# Altium project MBR.PrjPcb
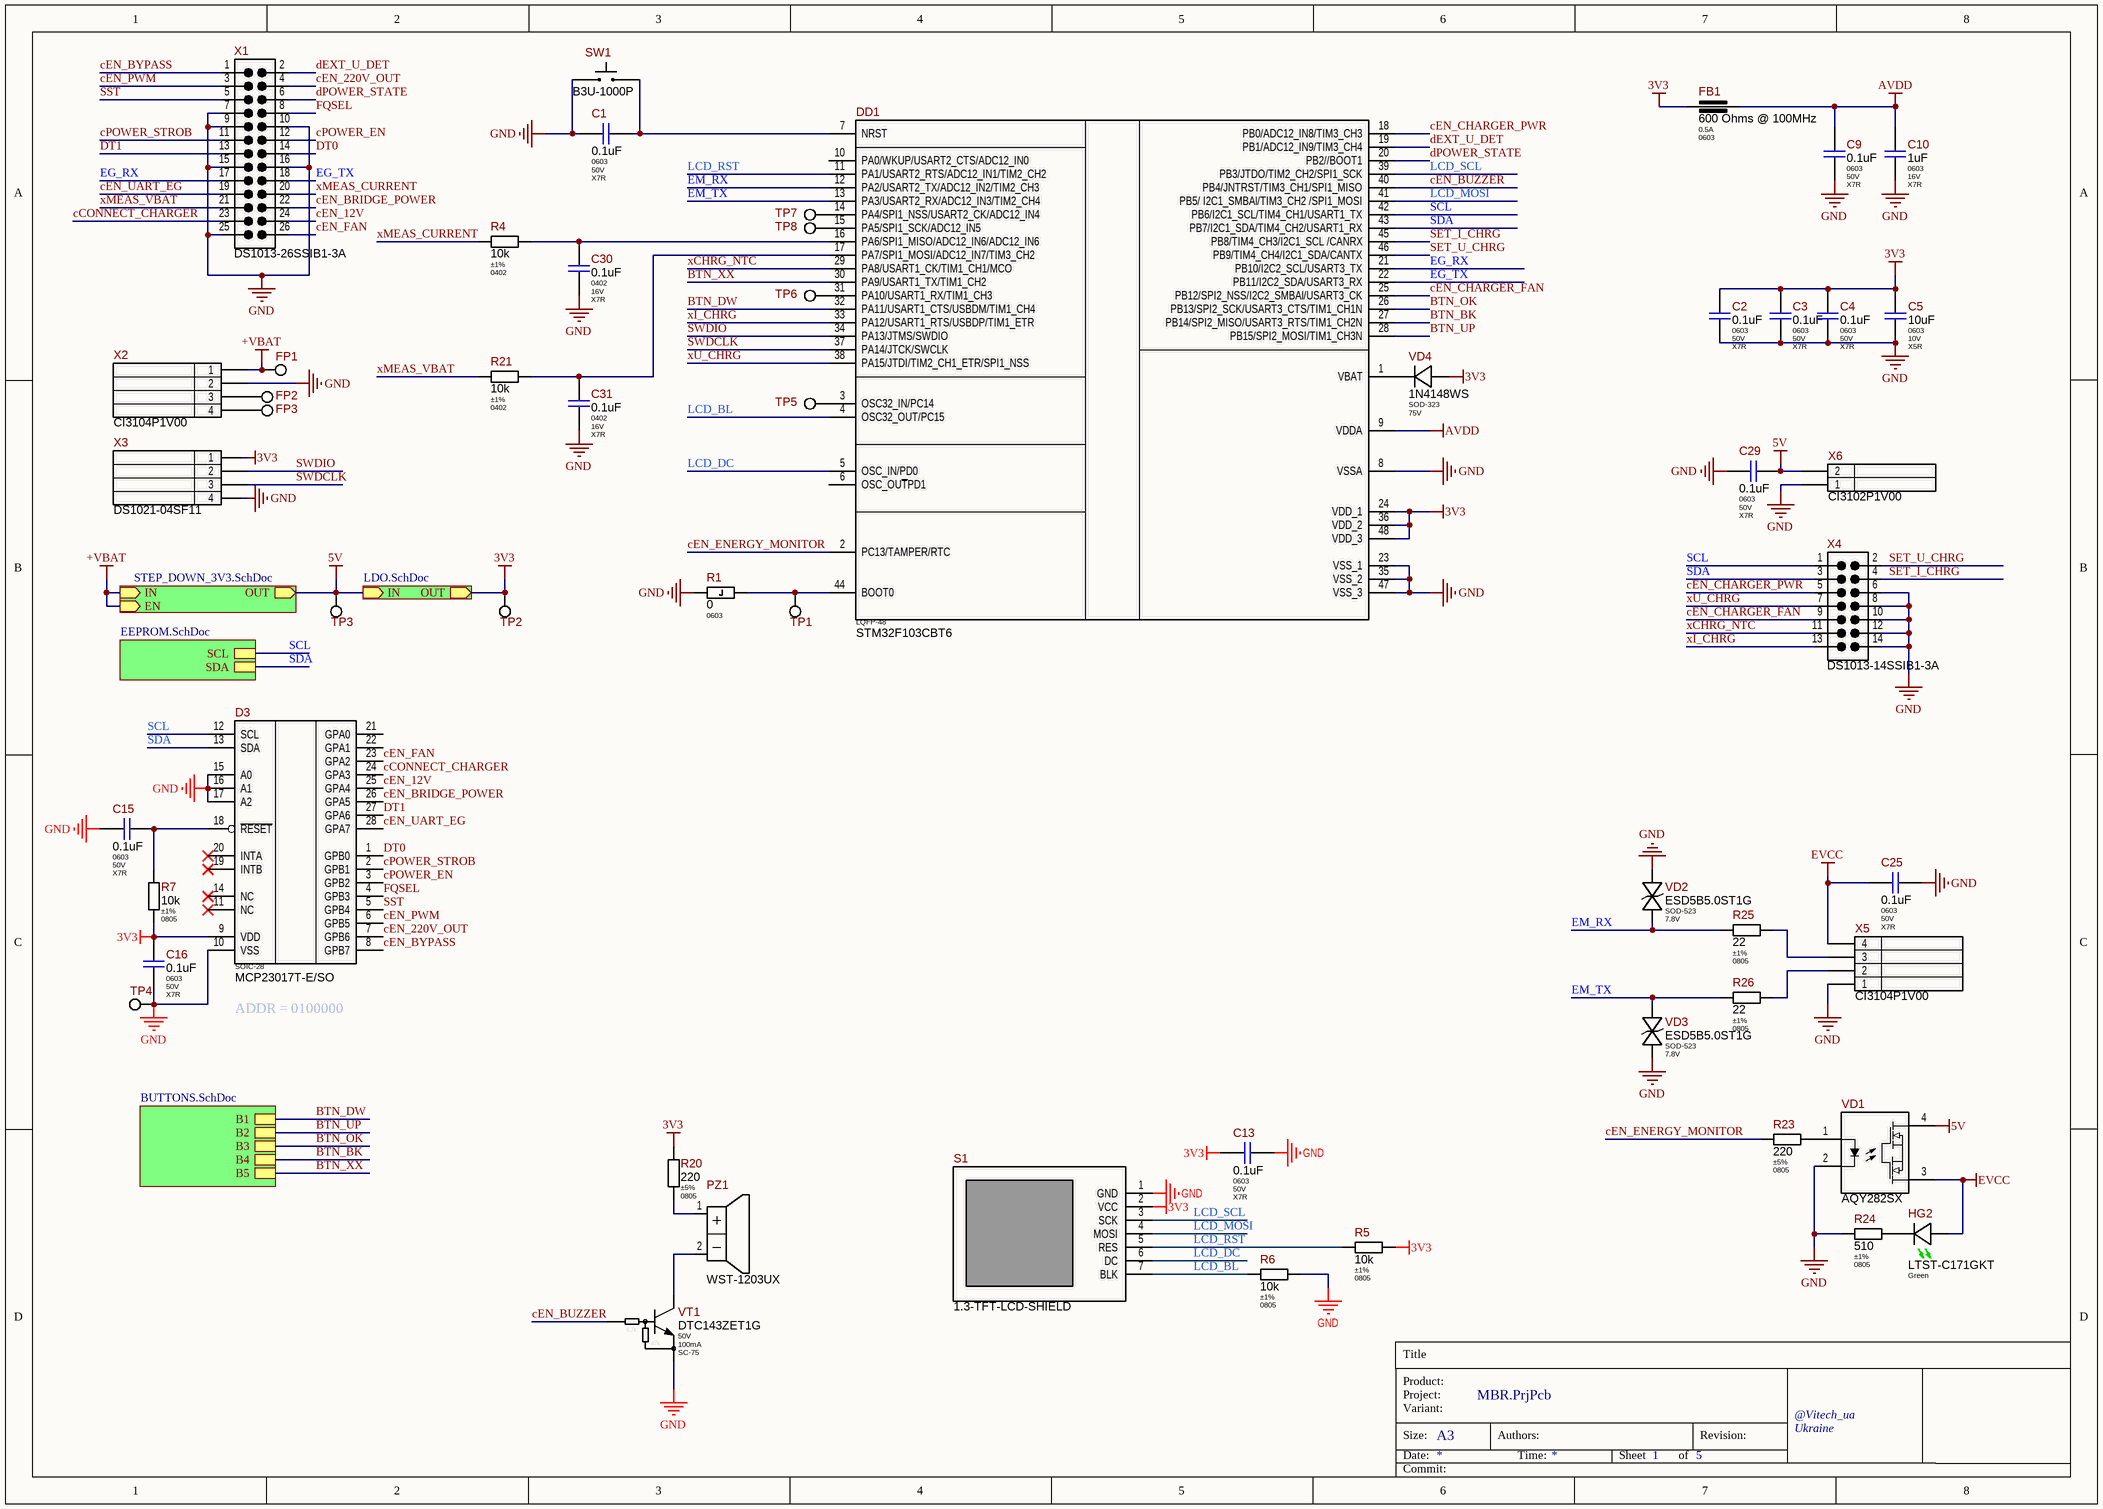
[diagram p0: MBR.SchDoc]
__Project_Template_Version: 1.0.2; _Amount_Boards_Per_Stand: 1; _PCB_Order_Accuracy: 0.2mm / 8mil; _PCB_Order_BoardOutlineLayer: Mechanical1 (GM1); _PCB_Order_Cooper: 1oz / 35um; _PCB_Order_ElectricTest: Necessarily for 100% samples; _PCB_Order_Finish: HASL; _PCB_Order_LayersCnt: 2; _PCB_Order_Mask: on both sides; _PCB_Order_MaskColor: Green / Yellow; _PCB_Order_Material: FR-4; _PCB_Order_MinHole: 0.3 mm; _PCB_Order_ProductionTime: 2 weeks; _PCB_Order_Silk: No; _PCB_Order_SilkColor: No; _PCB_Order_Size: 0 x 0 mm; _PCB_Order_Thickness: 1.6 mm; Authors: Vitech-ua; Product_Name: INVERTOR; Project_ID: 002; Project_Version: 1
5 sheets, 97 parts. Net scope: hierarchical (ports join the sheet entries above them; power ports are global).
Board file: MBR.PcbDoc
Sheets:
  MBR.SchDoc
    STEP_DOWN = STEP_DOWN_3V3.SchDoc
    EEPROM = EEPROM.SchDoc
    Designator = LDO.SchDoc
    Designator = BUTTONS.SchDoc

## Sheet MBR.SchDoc: =DocumentName
size A3; Author: Vitech-ua; CompanyName: "AS Manufacturing" LLC; Organization: "AS Manufacturing" LLC; Address1: 5 Sklyarenka St.; Address2: Kyiv 04073; Address3: Ukraine; Address4: https://ajax.systems/en/; Revision: v1; SheetNumber: 1; SheetTotal: 5; Product name: INVERTOR; Internal reference: 002; Head: INVERTOR.002.v1; PCB_Designator: INVERTOR.002.v1; Template_version: 1.0.1

### Parts
C1  Package: 0603  Voltage: 50V  Dielectric Type: X7R  [C_CERAMIC_0603_MED]  (hidden comment: 0.1uF)
C2  Package: 0603  Voltage: 50V  Dielectric Type: X7R  [C_CERAMIC_0603_MED]  (hidden comment: 0.1uF)
C3  Package: 0603  Voltage: 50V  Dielectric Type: X7R  [C_CERAMIC_0603_MED]  (hidden comment: 0.1uF)
C4  Package: 0603  Voltage: 50V  Dielectric Type: X7R  [C_CERAMIC_0603_MED]  (hidden comment: 0.1uF)
C5  Package: 0603  Voltage: 10V  Dielectric Type: X5R  [C_CERAMIC_0603_MED]  (hidden comment: 10uF)
C9  Package: 0603  Voltage: 50V  Dielectric Type: X7R  [C_CERAMIC_0603_MED]  (hidden comment: 0.1uF)
C10  Package: 0603  Voltage: 16V  Dielectric Type: X7R  [C_CERAMIC_0603_MED]  (hidden comment: 1uF)
C13  Package: 0603  Voltage: 50V  Dielectric Type: X7R  [C_CERAMIC_0603_MED]  (hidden comment: 0.1uF)
C15  Package: 0603  Voltage: 50V  Dielectric Type: X7R  [C_CERAMIC_0603_MED]  (hidden comment: 0.1uF)
C16  Package: 0603  Voltage: 50V  Dielectric Type: X7R  [C_CERAMIC_0603_MED]  (hidden comment: 0.1uF)
C25  Package: 0603  Voltage: 50V  Dielectric Type: X7R  [C_CERAMIC_0603_MED]  (hidden comment: 0.1uF)
C29  Package: 0603  Voltage: 50V  Dielectric Type: X7R  [C_CERAMIC_0603_MED]  (hidden comment: 0.1uF)
C30  Package: 0402  Voltage: 16V  Dielectric Type: X7R  [C_CERAMIC_0402_MED]  (hidden comment: 0.1uF)
C31  Package: 0402  Voltage: 16V  Dielectric Type: X7R  [C_CERAMIC_0402_MED]  (hidden comment: 0.1uF)
D3  Package: SOIC-28  [SOIC-28N_N]  (hidden comment: MCP23017T-E/SO)
DD1  STM32F103CBT6  [LQFP-48]
FB1  value 600 Ohms @ 100MHz  Current: 0.5A  Package: 0603  [BLM18KGxxxBH1x_MED]  (hidden comment: BLM18KG601BH1D)
FP1  PAD-1.75mm  [PAD-1.75mm]  (value not drawn)  (no BOM)
FP2  PAD-1.75mm  [PAD-1.75mm]  (value not drawn)  (no BOM)
FP3  PAD-1.75mm  [PAD-1.75mm]  (value not drawn)  (no BOM)
HG2  Color: Green  [LTST-C171GKT]  (hidden comment: LTST-C171GKT)
PZ1  WST-1203UX  [WST-1203UX]
R1  Package: 0603  [R_ANY_CHIP_0603_MED]  (hidden comment: 0)
R4  Tolerance: ±1%  Package: 0402  [R_ANY_CHIP_0402_MED]  (hidden comment: 10k)
R5  Tolerance: ±1%  Package: 0805  [R_ANY_CHIP_0805_MED]  (hidden comment: 10k)
R6  Tolerance: ±1%  Package: 0805  [R_ANY_CHIP_0805_MED]  (hidden comment: 10k)
R7  Tolerance: ±1%  Package: 0805  [R_ANY_CHIP_0805_MED]  (hidden comment: 10k)
R20  Tolerance: ±5%  Package: 0805  [R_ANY_CHIP_0805_MED]  (hidden comment: 220)
R21  Tolerance: ±1%  Package: 0402  [R_ANY_CHIP_0402_MED]  (hidden comment: 10k)
R23  Tolerance: ±5%  Package: 0805  [R_ANY_CHIP_0805_MED]  (hidden comment: 220)
R24  Tolerance: ±1%  Package: 0805  [R_ANY_CHIP_0805_MED]  (hidden comment: 510)
R25  Tolerance: ±1%  Package: 0805  [R_ANY_CHIP_0805_MED]  (hidden comment: 22)
R26  Tolerance: ±1%  Package: 0805  [R_ANY_CHIP_0805_MED]  (hidden comment: 22)
S1  1.3-LCD-Shield  [1.3-TFT-LCD-SHIELD]  (value not drawn)
SW1  B3U-1000P  [B3U-1000P]
TP1  PAD-0.96mm  [PAD-0.96mm]  (value not drawn)  (no BOM)
TP2  PAD-0.96mm  [PAD-0.96mm]  (value not drawn)  (no BOM)
TP3  PAD-0.96mm  [PAD-0.96mm]  (value not drawn)  (no BOM)
TP4  PAD-0.96mm  [PAD-0.96mm]  (value not drawn)  (no BOM)
TP5  PAD-0.96mm  [PAD-0.96mm]  (value not drawn)  (no BOM)
TP6  PAD-0.96mm  [PAD-0.96mm]  (value not drawn)  (no BOM)
TP7  PAD-0.96mm  [PAD-0.96mm]  (value not drawn)  (no BOM)
TP8  PAD-0.96mm  [PAD-0.96mm]  (value not drawn)  (no BOM)
VD1  AQY282SX  [SOP-4N]
VD2  Package: SOD-523  Voltage: 7.8V  [SOD-523F-Bi1_MED]  (hidden comment: ESD5B5.0ST1G)
VD3  Package: SOD-523  Voltage: 7.8V  [SOD-523F-Bi1_MED]  (hidden comment: ESD5B5.0ST1G)
VD4  Package: SOD-323  Voltage: 75V  [SOD-323_MED]  (hidden comment: 1N4148WS)
VT1  Vce: 50V  Ic: 100mA  Package: SC-75  [SOT-416]  (hidden comment: DTC143ZET1G)
X1  DS1013-26SSIB1-3A  [BH-26]
X2  WH-04S  [WF-4S]  (value not drawn)
X3  PLS-4 (Part of PLS-40)  [DS1021-04S]  (value not drawn)
X4  DS1013-14SSIB1-3A  [BH-14]
X5  WH-04S  [WF-4S]  (value not drawn)
X6  WH-02S  [WF-2S]  (value not drawn)

### Sub-sheets
Designator = LDO.SchDoc: IN (in), OUT (out)
Designator = BUTTONS.SchDoc: B1, B2, B3, B4, B5
EEPROM = EEPROM.SchDoc: SCL, SDA
STEP_DOWN = STEP_DOWN_3V3.SchDoc: IN (in), OUT (out), EN (in)

### Nets
3V3: C2.2 C3.2 C4.2 C5.2 C13.2 C16.2 D3.9(VDD) DD1.24(VDD_1) DD1.36(VDD_2) DD1.48(VDD_3) FB1.2 R5.2 R7.1 R20.2 S1.2(VCC) TP2.1 VD4.AN X3.1 ; sheet Designator/OUT
5V: C29.1 TP3.1 VD1.4(D1) X6.2 ; sheet STEP_DOWN/OUT, sheet Designator/IN
+VBAT: FP1.1 X2.1 ; sheet STEP_DOWN/IN, sheet STEP_DOWN/EN
AVDD: C9.2 C10.1 DD1.9(VDDA) FB1.1
EVCC: C25.1 HG2.AN(Anode) VD1.3(D2) X5.4
GND: C1.2 C2.1 C3.1 C4.1 C5.1 C9.1 C10.2 C13.1 C15.2 C16.1 C25.2 C29.2 C30.2 C31.2 D3.10(VSS) D3.15(A0) D3.16(A1) D3.17(A2) DD1.8(VSSA) DD1.23(VSS_1) DD1.35(VSS_2) DD1.47(VSS_3) R1.2 R6.2 R24.1 S1.1(GND) SW1.1 TP4.1 VD1.2(Cathode) VD2.AN2 VD3.AN1 VT1.2(E) X1.7 X1.9 X1.10 X1.15 X1.16 X1.25 X2.2 X3.4 X4.6 X4.8 X4.10 X4.12 X4.14 X5.1 X6.1
BTN_BK: DD1.27(PB14/SPI2_MISO/USART3_RTS/TIM1_CH2N) ; sheet Designator/B4
BTN_DW: DD1.32(PA11/USART1_CTS/USBDM/TIM1_CH4) ; sheet Designator/B1
BTN_OK: DD1.26(PB13/SPI2_SCK/USART3_CTS/TIM1_CH1N) ; sheet Designator/B3
BTN_UP: DD1.28(PB15/SPI2_MOSI/TIM1_CH3N) ; sheet Designator/B2
BTN_XX: DD1.30(PA9/USART1_TX/TIM1_CH2) ; sheet Designator/B5
cCONNECT_CHARGER: D3.24(GPA3) X1.23
cEN_12V: D3.25(GPA4) X1.24
cEN_220V_OUT: D3.7(GPB6) X1.4
cEN_BRIDGE_POWER: D3.26(GPA5) X1.22
cEN_BUZZER: DD1.40(PB4/JNTRST/TIM3_CH1/SPI1_MISO) VT1.1(B)
cEN_BYPASS: D3.8(GPB7) X1.1
cEN_CHARGER_FAN: DD1.25(PB12/SPI2_NSS/I2C2_SMBAl/USART3_CK) X4.9
cEN_CHARGER_PWR: DD1.18(PB0/ADC12_IN8/TIM3_CH3) X4.5
cEN_ENERGY_MONITOR: DD1.2(PC13/TAMPER/RTC) R23.2
cEN_FAN: D3.23(GPA2) X1.26
cEN_UART_EG: D3.28(GPA7) X1.19
cPOWER_EN: D3.3(GPB2) X1.12
cPOWER_STROB: D3.2(GPB1) X1.11
dEXT_U_DET: DD1.19(PB1/ADC12_IN9/TIM3_CH4) X1.2
dPOWER_STATE: DD1.20(PB2//BOOT1) X1.6
DT0: D3.1(GPB0) X1.14
DT1: D3.27(GPA6) X1.13
EG_RX: DD1.21(PB10/I2C2_SCL/USART3_TX) X1.17
EG_TX: DD1.22(PB11/I2C2_SDA/USART3_RX) X1.18
EM_RX: DD1.12(PA2/USART2_TX/ADC12_IN2/TIM2_CH3) R25.1 VD2.AN1
EM_TX: DD1.13(PA3/USART2_RX/ADC12_IN3/TIM2_CH4) R26.1 VD3.AN2
FQSEL: D3.4(GPB3) X1.8
LCD_BL: DD1.4(OSC32_OUT/PC15) R6.1 S1.7(BLK)
LCD_DC: DD1.5(OSC_IN/PD0) S1.6(DC)
LCD_MOSI: DD1.41(PB5/_I2C1_SMBAl/TIM3_CH2_/SPI1_MOSI) S1.4(MOSI)
LCD_RST: DD1.11(PA1/USART2_RTS/ADC12_IN1/TIM2_CH2) R5.1 S1.5(RES)
LCD_SCL: DD1.39(PB3/JTDO/TIM2_CH2/SPI1_SCK) S1.3(SCK)
SCL: D3.12(SCL) DD1.42(PB6/I2C1_SCL/TIM4_CH1/USART1_TX) X4.1 ; sheet EEPROM/SCL
SDA: D3.13(SDA) DD1.43(PB7/I2C1_SDA/TIM4_CH2/USART1_RX) X4.3 ; sheet EEPROM/SDA
SET_I_CHRG: DD1.45(PB8/TIM4_CH3/I2C1_SCL_/CANRX) X4.4
SET_U_CHRG: DD1.46(PB9/TIM4_CH4/I2C1_SDA/CANTX) X4.2
SST: D3.5(GPB4) X1.5
SWDCLK: DD1.37(PA14/JTCK/SWCLK) X3.3
SWDIO: DD1.34(PA13/JTMS/SWDIO) X3.2
xCHRG_NTC: DD1.29(PA8/USART1_CK/TIM1_CH1/MCO) X4.11
xI_CHRG: DD1.33(PA12/USART1_RTS/USBDP/TIM1_ETR) X4.13
xMEAS_CURRENT: R4.1 X1.20
xMEAS_VBAT: R21.1 X1.21
xU_CHRG: DD1.38(PA15/JTDI/TIM2_CH1_ETR/SPI1_NSS) X4.7
сEN_PWM: D3.6(GPB5) X1.3
NetC1_1: C1.1 DD1.7(NRST) SW1.2
NetC15_1: C15.1 D3.18(~{RESET}) R7.2
NetC30_1: C30.1 DD1.16(PA6/SPI1_MISO/ADC12_IN6/ADC12_IN6) R4.2
NetC31_1: C31.1 DD1.17(PA7/SPI1_MOSI/ADC12_IN7/TIM3_CH2) R21.2
NetDD1_1: DD1.1(VBAT) VD4.CA
NetDD1_3: DD1.3(OSC32_IN/PC14) TP5.1
NetDD1_14: DD1.14(PA4/SPI1_NSS/USART2_CK/ADC12_IN4) TP7.1
NetDD1_15: DD1.15(PA5/SPI1_SCK/ADC12_IN5) TP8.1
NetDD1_31: DD1.31(PA10/USART1_RX/TIM1_CH3) TP6.1
NetDD1_44: DD1.44(BOOT0) R1.1 TP1.1
NetFP2_1: FP2.1 X2.3
NetFP3_1: FP3.1 X2.4
NetHG2_CA: HG2.CA(Cathode) R24.2
NetPZ1_1: PZ1.1(Positive) R20.1
NetPZ1_2: PZ1.2(Negative) VT1.3(C)
NetR23_1: R23.1 VD1.1(Anode)
NetR25_2: R25.2 X5.3
NetR26_2: R26.2 X5.2

Not connected (* = marked no-connect by the designer): D3 11(NC)* 14(NC)* 19(INTB)* 20(INTA)* 21(GPA0) 22(GPA1); DD1 6(OSC_OU~{T}PD1) 10(PA0/WKUP/USART2_CTS/ADC12_IN0)

### Notes on the sheet
- (near D3) ADDR = 0100000
- Title
- Product:
- Project:
- Size:
- Date:
- Variant:
- A3
- Authors:
- Time:
- Sheet
- of
- Revision:
- @Vitech_ua
- Commit:
- (in symbol DTC143ZET1G) 4.7k; 47k

### Library data of the parts
C1-C4 C9 C13 C15 C16 C25 C29 = CL10B104KB8NNND: 100nF 50V X7R ±10% 0603 Ceramic Capacitor RoHS; Manufacturer: Samsung Electro-Mechanics; Ajax_1C_ID: 21313; Ajax_1C_PN: 100nF 50V X7R 10% 0603 CL10B104KB8NNND ceramic capacitor SMD; Ajax_1С_Status: Substitution; Standard Lead Time: 18 Weeks; Component Status: Released; Replacement: CL10B104KB8NNNC; GUID_1C: f1fd6399-ca68-11ea-ab63-0050569f2651; Value: 0.1uF; Part Number: CL10B104KB8NNND; Part Type: Ceramic / X7R / 0603; Component Type: SMD; Temperature Range: -55°C ~ 125°C; Tolerance: ±10%; ComponentLink1URL: https://media.digikey.com/pdf/Data%20Sheets/Samsung%20PDFs/CL_Series_MLCC_ds.pdf; Supplier 1: Digi-Key; Supplier Part Number 1: CL10B104KB8NNND-ND; Price: 0,0039378; ComponentLink1Description: Datasheet
C5 = CL10A106KP8NNNC: 10uF 10V X5R ±10% 0603 Ceramic Capacitor RoHS; Manufacturer: Samsung Electro-Mechanics; Ajax_1C_ID: 20452; Ajax_1C_PN: 10uF 10V 10% 0603 CL10A106KP8NNNC Ceramic Capacitor SMD RoHS; Ajax_1С_Status: Substitution; Standard Lead Time: 22 Weeks; Component Status: Released; Replacement: NONE; GUID_1C: 10ec15c4-96a3-11ea-ab61-0050569f2651; Value: 10uF; Part Number: CL10A106KP8NNNC; Part Type: Ceramic / X5R / 0603; Component Type: SMD; Temperature Range: -55°C ~ 85°C; Tolerance: ±10%; ComponentLink1URL: https://media.digikey.com/pdf/Data%20Sheets/Samsung%20PDFs/CL10A106KP8NNNC_Spec.pdf; Supplier 1: Digi-Key; Supplier Part Number 1: 1276-1192-2-ND; Price: 0,0106; ComponentLink1Description: Datasheet
C10 = CL10B105KO8NNNC: 1uF 16V X7R ±10% 0603 Ceramic Capacitor RoHS; Manufacturer: Samsung Electro-Mechanics; Ajax_1C_ID: 7734; Ajax_1C_PN: 1uF 16V X7R 10% 0603 CL10B105KO8NNNC Ceramic Capacitor SMD RoHS; Ajax_1С_Status: Mass Production; Standard Lead Time: 18 Weeks; Component Status: Released; Replacement: NONE; GUID_1C: 0e0d4f9c-d19c-11e5-8143-d8cb8a9acc66; Value: 1uF; Part Number: CL10B105KO8NNNC; Part Type: Ceramic / X7R / 0603; Component Type: SMD; Temperature Range: -55°C ~ 125°C; Tolerance: ±10%; ComponentLink1URL: https://media.digikey.com/pdf/Data%20Sheets/Samsung%20PDFs/CL_Series_MLCC_ds.pdf; Supplier 1: Digi-Key; Supplier Part Number 1: 1276-1019-2-ND; Price: 0,00367919; ComponentLink1Description: Datasheet
C30 C31 = CC0402JRX7R7BB104: 100nF 16V X7R ±5% 0402 Ceramic Capacitor RoHS; Manufacturer: Yageo; Ajax_1C_ID: 4828; Ajax_1C_PN: 100nF 16V X7R 5% 0402 GRM155R71C104JA88D / CC0402JRX7R7BB104 Ceramic Capacitor SMD RoHS; Ajax_1С_Status: Mass Production; Standard Lead Time: 33 Weeks; Component Status: Released; Replacement: NONE; GUID_1C: 757af6f0-083e-11e4-b679-a45d36c4a9e5; Value: 0.1uF; Part Number: CC0402JRX7R7BB104; Part Type: Ceramic / X7R / 0402; Component Type: SMD; Temperature Range: -55°C ~ 125°C; Tolerance: ±5%; ComponentLink1URL: https://www.yageo.com/upload/media/product/productsearch/datasheet/mlcc/UPY-GPHC_X7R_6.3V-to-50V_18.pdf; Supplier 1: Digi-Key; Supplier Part Number 1: 311-1676-2-ND; Price: 0,003; ComponentLink1Description: Datasheet
D3 = MCP23017T-E/SO: I/O Expander 16 I2C 1.7MHz, SOIC-28; Manufacturer: Microchip Technology; Ajax_1C_ID: 14445; Ajax_1C_PN: MCP23017T-E/SO Microchip I/O Expander I2C 28-SOIC; Ajax_1С_Status: RND Only; Standard Lead Time: 12 Weeks; Component Status: On Review; Replacement: NONE; GUID_1C: 76bcf1a9-fe09-11e8-ab4d-0050569f2651; Part Number: MCP23017T-E/SO; Part Type: Interface / IO Expander; Component Type: SMD; Temperature Range: -40°C ~ 125°C; ComponentLink1URL: https://ww1.microchip.com/downloads/en/DeviceDoc/20001952C.pdf; Supplier 1: Digi-Key; Supplier Part Number 1: MCP23017T-E/SOTR-ND; Price: 1,2402; ComponentLink1Description: Datasheet
DD1 = STM32F103CBT6: ARM Cortex-M3 MCU with 128 kB Flash, 72 MHz CPU, USB and CAN, LQFP-48; Manufacturer: STMicroelectronics; Ajax_1C_ID: 53694; Ajax_1C_PN: STM32F103CBT6 IC MCU 32BIT 128KB FLASH 48LQFP ST; Ajax_1С_Status: RND Only; Standard Lead Time: 52 Weeks; Component Status: Released; Replacement: NONE; GUID_1C: e1b5048f-59bb-11ed-a364-005056994834; Package: LQFP-48; Part Number: STM32F103CBT6; Part Type: MCU / ARM Cortex-M3; Component Type: SMD; Temperature Range: -40°C ~ 85°C; ComponentLink1URL: https://eu.mouser.com/datasheet/2/389/stm32f103c8-1851025.pdf; Supplier 1: Mouser; Supplier Part Number 1: 511-STM32F103CBT6; Price: 2,873125; ComponentLink1Description: Datasheet
FB1 = BLM18KG601BH1D: 600 Ohms @ 100MHz Power Line Ferrite Bead 0603, 500mA 150mOhm; Manufacturer: Murata Electronics; Ajax_1C_ID: 20206; Ajax_1C_PN: 600R 500mA 0603 BLM18KG601BH1D Murata ferrite bead; Ajax_1С_Status: Mass Production; Saturation Current: NONE; Tolerance: ±25%; Component Status: Released; Standard Lead Time: 7 Weeks; GUID_1C: cce02533-8605-11ea-ab60-0050569f2651; Part Number: BLM18KG601BH1D; Part Type: Ferrite Bead; Component Type: SMD; Temperature Range: -55°C ~ 150°C; ComponentLink1URL: https://www.murata.com/en-us/products/productdata/8798137286686/QNFA9129.pdf; Supplier 1: Digi-Key; Supplier Part Number 1: 490-14032-2-ND; Replacement: NONE; Price: 0.01096; ComponentLink1Description: Datasheet
FP1-FP3 = PAD-1.75mm: 1.75mm Pad for Plug-In or Receptacle; Ajax_1C_PN: NONE; Ajax_1С_Status: RND Only; Component Status: Released; Part Number: PAD-1.75mm; Component Type: PTH; Manufacturer: NONE; Part Type: Pad; Temperature Range: NONE; ComponentLink1URL: NONE; Replacement: NONE; Price: NONE; ComponentLink1Description: Datasheet
HG2 = LTST-C171GKT: Low Power LED, Green 565nm, Clear, SMD 0805, Vf 2.1V - 2.6V, 5 ~ 12mcd @ 20 mA, 130°; Manufacturer: Lite-On Optoelectronics; Ajax_1C_ID: 30364; Ajax_1C_PN: LTST-C171GKT Green SMD LED 0805 12mcd 20mA 130deg RoHS; Ajax_1С_Status: RND Only; Component Status: Released; Replacement: NONE; GUID_1C: df39881f-c399-11eb-ab74-0050569f2651; Part Number: LTST-C171GKT; Part Type: LED / 0805; Component Type: SMD; Package: 0805; Wavelength: 565nm; Temperature Range: -55°C ~ 85°C; ComponentLink1URL: https://media.digikey.com/pdf/Data%20Sheets/Lite-On%20PDFs/LTST-C171GKT.pdf; Supplier 1: Digi-Key; Supplier Part Number 1: 160-1423-2-ND; Price: 0,0319; ComponentLink1Description: Datasheet
PZ1 = WST-1203UX: Buzzer, Internally Driven Magnetic 3V 30mA 2.3kHz 82dB @ 3V, 10cm, PTH; Manufacturer: Soberton; Ajax_1C_ID: 67190; Ajax_1C_PN: WST-1203UX BUZZER MAGNETIC 3V 12MM TH Soberton Inc.; Ajax_1С_Status: RND Only; Component Status: Released; Replacement: NONE; GUID_1C: b4e25317-da9e-11ed-a91d-00505699469b; Part Number: WST-1203UX; Part Type: Buzzer; Component Type: PTH; Temperature Range: -20°C ~ 60°C; ComponentLink1URL: https://www.soberton.com/wp-content/uploads/2019/02/WST-1203UX.-17-Feb-2019-pdf.pdf; Supplier 1: Digi-Key; Supplier Part Number 1: 433-1047-ND; Price: 1,214; ComponentLink1Description: Datasheet
R1 = RC0603JR-070RL: 0 Ohms Jumper, 1/10W 0603 Thick Film Resistor; Manufacturer: Yageo; Tolerance: ±5%; Ajax_1C_ID: 2857; Ajax_1C_PN: 0R 5% 0603 Resistors SMD RoHS; Ajax_1С_Status: Mass Production; Power Rating: 0.1W; Voltage: 75V; Component Status: Released; Temperature Stability: NONE; GUID_1C: df4c284c-e567-11e2-9779-6c626deda1bb; Value: 0; Part Number: RC0603JR-070RL; Component Type: SMD; Part Type: Thick Film; Temperature Range: -55°C ~ 155°C; ComponentLink1URL: https://eu.mouser.com/datasheet/2/447/PYu_RC_Group_51_RoHS_L_10-1664068.pdf; Supplier 1: Digi-Key; Supplier Part Number 1: 311-0.0GRTR-ND; Replacement: NONE; Price: 0,0006; ComponentLink1Description: Datasheet
R4 R21 = RC0402FR-0710KL: 10 kOhms ±1% 1/16W 0402 Thick Film Resistor; Manufacturer: Yageo; Ajax_1C_ID: 6717; Ajax_1C_PN: 10k 1% 0402 Resistors SMD RoHS; Ajax_1С_Status: Mass Production; Power Rating: 0.062W; Voltage: 50V; Component Status: Released; Temperature Stability: ±100ppm/°C; Replacement: NONE; GUID_1C: 2e173059-2610-11e5-ad28-a45d36c4a9e5; Value: 10k; Part Number: RC0402FR-0710KL; Component Type: SMD; Part Type: Thick Film; Temperature Range: -55°C ~ 155°C; ComponentLink1URL: https://eu.mouser.com/datasheet/2/447/PYu_RC_Group_51_RoHS_L_10-1664068.pdf; Supplier 1: Digi-Key; Supplier Part Number 1: 311-10.0KLRTR-ND; Price: 0,00065; ComponentLink1Description: Datasheet
R5-R7 = RC0805FR-0710K2L: 10 kOhms ±1%, 1/8W 0805 Thick Film Resistor; Manufacturer: Yageo; Ajax_1C_ID: 13943; Ajax_1C_PN: 10.2k 1% 0805 Resistors SMD RoHS; Ajax_1С_Status: Mass Production; Power Rating: 0.125W; Voltage: 150V; Component Status: Released; Temperature Stability: ±100ppm/°C; Replacement: NONE; GUID_1C: 8bc9d0ce-c58a-11e8-ab47-0050569f2651; Value: 10k; Part Number: RC0805FR-0710K2L; Component Type: SMD; Part Type: Thick Film; Temperature Range: -55°C ~ 155°C; ComponentLink1URL: https://eu.mouser.com/datasheet/2/447/PYu_RC_Group_51_RoHS_L_10-1664068.pdf; Supplier 1: Digi-Key; Supplier Part Number 1: 311-10.2KCRTR-ND; Price: 0,0014; ComponentLink1Description: Datasheet
R20 R23 = RC0805JR-07220RL: 220 Ohms ±5%, 1/8W 0805 Thick Film Resistor; Manufacturer: Yageo; Ajax_1C_ID: 7127; Ajax_1C_PN: 220R 5% 0805 Resistors SMD RoHS; Ajax_1С_Status: RND Only; Power Rating: 0.125W; Voltage: 150V; Component Status: Released; Temperature Stability: ±100ppm/°C; Replacement: NONE; GUID_1C: 9c0a86ee-7805-11e5-9653-a45d36c4a9e5; Value: 220; Part Number: RC0805JR-07220RL; Component Type: SMD; Part Type: Thick Film; Temperature Range: -55°C ~ 155°C; ComponentLink1URL: https://eu.mouser.com/datasheet/2/447/PYu_RC_Group_51_RoHS_L_10-1664068.pdf; Price: 0,0017; ComponentLink1Description: Datasheet
R24 = ERJ-P06F5100V: 510 Ohms ±1%, 1/2W 0805 High Power Thick Film Resistor; Manufacturer: Panasonic; Ajax_1C_ID: 15765; Ajax_1C_PN: 510R 1% 0.5W 0805 Panasonic ERJ-P06F5100V Resistors SMD RoHS; Ajax_1С_Status: RND Only; Power Rating: 0.5W; Voltage: 400V; Component Status: Released; Temperature Stability: ±100ppm/°C; Replacement: NONE; GUID_1C: 3592f296-62b5-11e9-ab4f-0050569f2651; Value: 510; Part Number: ERJ-P06F5100V; Component Type: SMD; Part Type: Thick Film / Anti-Surge/Pulse Withstanding; Temperature Range: -55°C ~ 155°C; ComponentLink1URL: https://eu.mouser.com/datasheet/2/315/AOA0000C331-1141874.pdf; Supplier 1: Mouser; Supplier Part Number 1: 667-ERJ-P06F5100V; Price: 0,036096; ComponentLink1Description: Datasheet
R25 R26 = RC0805FR-0722RL: 22 Ohms ±1%, 1/8W 0805 Thick Film Resistor; Manufacturer: Yageo; Ajax_1C_ID: 19974; Ajax_1C_PN: 22R 1% 0805  Resistors SMD RoHS; Ajax_1С_Status: Mass Production; Power Rating: 0.125W; Voltage: 150V; Component Status: Released; Temperature Stability: ±100ppm/°C; Replacement: NONE; GUID_1C: cdbdcf96-797d-11ea-ab5f-0050569f2651; Value: 22; Part Number: RC0805FR-0722RL; Component Type: SMD; Part Type: Thick Film; Temperature Range: -55°C ~ 155°C; ComponentLink1URL: https://eu.mouser.com/datasheet/2/447/PYu_RC_Group_51_RoHS_L_11-1984063.pdf; Supplier 1: Digi-Key; Supplier Part Number 1: 311-22.0CRTR-ND; Price: 0,0014; ComponentLink1Description: Datasheet
S1 = 1.3-TFT-LCD-SHIELD: 1.3 Inch SPI TFT LCD Module, ST7789 Controller; Manufacturer: Undefined; Ajax_1C_ID: 17121; Ajax_1C_PN: 1.3" 240х240 IPS TFT LCD цветной дисплей контроллер ST7789; Ajax_1С_Status: RND Only; Component Status: Released; Replacement: NONE; GUID_1C: 4f8eff20-d085-11e9-ab57-0050569f2651; Part Type: LCD Shield; Component Type: PTH; Temperature Range: NONE; ComponentLink1URL: NONE; Price: 6,89115799; ComponentLink1Description: Datasheet; Part Number: 1.3-TFT-LCD-SHIELD
SW1 = B3U-1000P: Tactile Switch SPST-NO SMD, 153gf, Height 1.6mm; Manufacturer: Omron; Ajax_1C_ID: 22077; Ajax_1C_PN: B3U-1000P кнопка тактовая, L=1.2mm, размер 3 x 2.5mm; Ajax_1С_Status: RND Only; Component Status: Released; Replacement: NONE; GUID_1C: a255acaa-eebd-11ea-ab64-0050569f2651; Part Number: B3U-1000P; Lifecycle: Not Recommended; Part Type: Switch / Tactile; Component Type: SMD; Temperature Range: -25°C ~ 70°C; ComponentLink1URL: https://eu.mouser.com/datasheet/2/307/en-b3u-3615.pdf; Supplier 1: Digi-Key; Supplier Part Number 1: SW1020CT-ND; Price: 0,78981818; ComponentLink1Description: Datasheet
TP1-TP8 = PAD-0.96mm: 0.96mm Pad for Plug-In or Receptacle; Ajax_1C_PN: NONE; Ajax_1С_Status: RND Only; Component Status: Released; Part Number: PAD-0.96mm; Component Type: PTH; Manufacturer: NONE; Part Type: Pad; Temperature Range: NONE; ComponentLink1URL: NONE; Replacement: NONE; Price: NONE; ComponentLink1Description: Datasheet
VD1 = AQY282SX: PhotoMOS Solid State Relay, SPST-NO, 0-60V, 0.5A, 2.5Ohm Max, SOP-4; Manufacturer: Panasonic Electric Works; Ajax_1C_ID: 14630; Ajax_1С_Status: RND Only; Component Status: Released; Wavelength: NONE; GUID_1C: ce83abfa-13e9-11e9-ab4d-0050569f1984; Part Number: AQY282SX; Ajax_1C_PN: AQY282SX; Part Type: MOS Relay; Component Type: SMD; Package: SOP-4; Color: NONE; Temperature Range: -40°C ~ 85°C; ComponentLink1URL: https://media.digikey.com/pdf/Data%20Sheets/Panasonic%20Electric%20Works%20PDFs/AQW,AQY280,282,284.pdf; Supplier 1: Digi-Key; Supplier Part Number 1: 255-3393-2-ND; Replacement: NONE; Price: 0,57; ComponentLink1Description: Datasheet
VD2 VD3 = ESD5B5.0ST1G: Bidirectional ESD Protection Diode, 5V Working Voltage, 32pF, SOD-523; Manufacturer: Onsemi; Ajax_1C_PN: NONE; Ajax_1С_Status: RND Only; Marking: B5; Component Status: On Review; Standard Lead Time: 15 Weeks; Part Number: ESD5B5.0ST1G; Part Type: TVS / ESD Protection; Component Type: SMD; Temperature Range: -55°C ~ 150°C; ComponentLink1URL: https://eu.mouser.com/datasheet/2/308/1/ESD5B5_0ST1_D-2311335.pdf; Supplier 1: Mouser; Supplier Part Number 1: 863-ESD5B50ST1G; Replacement: NONE; Price: NONE; ComponentLink1Description: Datasheet
VD4 = 1N4148WS: Diode Standard 75V 150mA, SOD-323F; Manufacturer: Diodec Semiconductor; Ajax_1C_ID: 10255; Ajax_1C_PN: 1N4148WS diotec SOD-323; Ajax_1С_Status: Mass Production; Marking: W2; Component Status: Released; Standard Lead Time: NONE; Vf: 1V @ 50mA; Replacement: 1N4148WS-E; GUID_1C: 3d8ac204-519f-11e7-8106-14dda9d2d04d; Part Type: Fast Switching; Component Type: SMD; Current: 150mA; Temperature Range: -55°C ~ 150°C; ComponentLink1URL: https://diotec.com/tl_files/diotec/files/pdf/datasheets/1n4148ws.pdf; Supplier 1: TME; Supplier Part Number 1: 1N4148WS-DIO; Price: 0,00864; ComponentLink1Description: Datasheet; Part Number: 1N4148WS
VT1 = DTC143ZET1G: 50V, 100mA Low Vce(sat) NPN Digital Transistor, Pre-Biased 4.7k/47k (with built-in resistors); Manufacturer: Onsemi; Ajax_1C_ID: 9410; Ajax_1C_PN: DTC143ZET1G SC-75-3  биполярный NPN транзистор; Ajax_1С_Status: Mass Production; Component Status: Released; Standard Lead Time: 8 Weeks; Replacement: NONE; GUID_1C: d76ac5d5-de69-11e6-829b-d8cb8a9acc66; Part Number: DTC143ZET1G; Part Type: NPN; Component Type: SMD; Temperature Range: -55°C ~ 150 °C; ComponentLink1URL: http://www.onsemi.com/pub/Collateral/DTC143Z-D.PDF; Supplier 1: Digi-Key; Supplier Part Number 1: DTC143ZET1GOSTR-ND; Price: 0,0125; ComponentLink1Description: Datasheet
X1 = DS1013-26SSIB1-3A: 2.54mm Vertical Box Header, Two Rows, 26 Pin, 20mOhm max, Male IDC BH-26; Manufacturer: Connfly; Ajax_1C_ID: 14527; Ajax_1C_PN: BH-26 : Вилка в плату IDC : IDC-26; Ajax_1С_Status: RND Only; Component Status: Released; Replacement: NONE; GUID_1C: b61e51fd-0757-11e9-ab4d-0050569f2651; System: Connector; Part Number: DS1013-26SSIB1-3A; Part Type: IDC (Box Header) / Vertical; Component Type: PTH; Temperature Range: -40°C ~ 105°C; ComponentLink1URL: \\altiumdb.ajax.local\files\Datasheet\Connectors\DS1013.pdf; Price: 0,1; ComponentLink1Description: Datasheet
X2 X5 = CI3104P1V00: WH Series 2.54mm Wire to Board Straight DIP Type Headers, 4 Pin; Manufacturer: CviLux; Ajax_1C_ID: 1232; Ajax_1C_PN: WF-04S, разъем 4 пина "папа", на плату; Ajax_1С_Status: RND Only; Component Status: Released; Replacement: NONE; GUID_1C: 2c368b74-dd41-11e0-af93-6c626deda1bb; Part Number: CI3104P1V00; Part Type: Wire-to-Board / Header; Component Type: PTH; Temperature Range: -25℃ ~ 85℃; ComponentLink1URL: \\altiumdb.ajax.local\files\Datasheet\Connectors\CI3102S.pdf; Price: 0,01936; ComponentLink1Description: Datasheet
X3 = DS1021-04SF11: 4 Pin 2.54mm Male Header, Vertical, 3mm and 6.1mm, PLS-4; Manufacturer: Connfly; Ajax_1C_ID: 1215; Ajax_1C_PN: PLS40, планки со штырьками; Ajax_1С_Status: Mass Production; Component Status: Released; Replacement: NONE; GUID_1C: 10be163c-dd40-11e0-af93-6c626deda1bb; Part Number: DS1021-04SF11; Part Type: Header / Male Pin / Single Row; Component Type: PTH; Temperature Range: -40°C ~ 105°C; ComponentLink1URL: \\altiumdb.ajax.local\files\Datasheet\Connectors\DS1021.pdf; Price: 0,001875; ComponentLink1Description: Datasheet
X4 = DS1013-14SSIB1-3A: 2.54mm Streight Box Header, Two Rows, 14 Pin, 20mOhm max, Male IDC BH-14; Manufacturer: Connfly; Ajax_1C_ID: 28120; Ajax_1C_PN: BH-14 Вилка в плату IDC; Ajax_1С_Status: RND Only; Component Status: Released; Replacement: NONE; GUID_1C: 134bd8be-8d66-11eb-ab70-0050569f2651; Part Number: DS1013-14SSIB1-3A; Part Type: IDC (Box Header) / Vertical; Component Type: PTH; Temperature Range: -40°C ~ 105°C; ComponentLink1URL: \\altiumdb.ajax.local\files\Datasheet\Connectors\DS1013.pdf; Price: 0,06; ComponentLink1Description: Datasheet
X6 = CI3102P1V00: WH Series 2.54mm Wire to Board Straight DIP Type Headers, 2 Pin; Manufacturer: CviLux; Ajax_1C_ID: 6817; Ajax_1C_PN: WF-02S (DS1070-2M) Штекер "папа"; 2 контакта; шаг 2.54мм; прямой; на плату; Ajax_1С_Status: RND Only; Component Status: Released; Replacement: NONE; GUID_1C: 74812bc3-35d6-11e5-ad28-a45d36c4a9e5; Part Number: CI3102P1V00; Part Type: Wire-to-Board / Header; Component Type: PTH; Temperature Range: -25℃ ~ 85℃; ComponentLink1URL: \\altiumdb.ajax.local\files\Datasheet\Connectors\CI3102S.pdf; Price: 0,016; ComponentLink1Description: Datasheet

## Sheet STEP_DOWN_3V3.SchDoc: =DocumentName
size A4; ENG_APP_DATE: --/--/--; DSN_APP_DATE: --/--/--; CHK_APP_DATE: --/--/--; Author: Vitech-ua; CompanyName: "AS Manufacturing" LLC; Organization: "AS Manufacturing" LLC; Address1: 5 Sklyarenka St.; Address2: Kyiv 04073; Address3: Ukraine; Address4: https://ajax.systems/en/; Revision: v1; SheetNumber: 2; SheetTotal: 5; Product name: INVERTOR; Internal reference: 002; Head: INVERTOR.002.v1; PCB_Designator: INVERTOR.002.v1; Template_version: 1.0.1
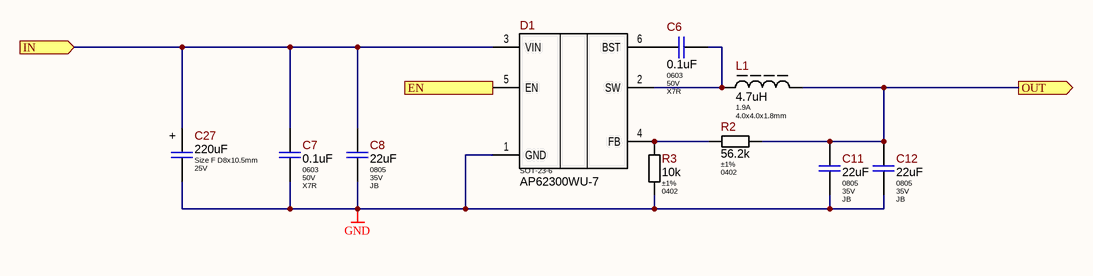
[diagram p1: STEP_DOWN_3V3.SchDoc]

### Parts
C6  Package: 0603  Voltage: 50V  Dielectric Type: X7R  [C_CERAMIC_0603_MED]  (hidden comment: 0.1uF)
C7  Package: 0603  Voltage: 50V  Dielectric Type: X7R  [C_CERAMIC_0603_MED]  (hidden comment: 0.1uF)
C8  Package: 0805  Voltage: 35V  Dielectric Type: JB  [CAP-0805(2012)X125T20]  (hidden comment: 22uF)
C11  Package: 0805  Voltage: 35V  Dielectric Type: JB  [CAP-0805(2012)X125T20]  (hidden comment: 22uF)
C12  Package: 0805  Voltage: 35V  Dielectric Type: JB  [CAP-0805(2012)X125T20]  (hidden comment: 22uF)
C27  value 220uF  Package: Size F D8x10.5mm  Voltage: 25V  [CAP-AE-830x1100H50_MED]  (hidden comment: 220uFx25V)
D1  AP62300WU-7  [SOT-23-6]
L1  Current: 1.9A  Package: 4.0x4.0x1.8mm  [SRN4018-Series_1.8mm]  (hidden comment: 4.7uH)
R2  Tolerance: ±1%  Package: 0402  [R_ANY_CHIP_0402_MED]  (hidden comment: 56.2k)
R3  Tolerance: ±1%  Package: 0402  [R_ANY_CHIP_0402_MED]  (hidden comment: 10k)

### Ports
EN (in), IN (in), OUT (out)

### Nets
5V: C11.1 C12.1 L1.2 R2.2 ; port OUT
+VBAT: C7.2 C8.1 C27.1 D1.3(VIN) D1.5(EN) ; port IN, port EN
GND: C7.1 C8.2 C11.2 C12.2 C27.2 D1.1(GND) R3.2
NetC6_1: C6.1 D1.2(SW) L1.1
NetC6_2: C6.2 D1.6(BST)
NetD1_4: D1.4(FB) R2.1 R3.1

### Notes on the sheet
- Title
- Product:
- Project:
- Size:
- Date:
- Variant:
- A4
- Authors:
- Time:
- Sheet
- of
- Revision:
- @Vitech_ua
- Commit:
- (in symbol MRA-025V221MF105-T/R) +

### Library data of the parts
C6 C7 = CL10B104KB8NNND: as C1 on sheet MBR; Value: 0.1uF; Part Number: CL10B104KB8NNND; Part Type: Ceramic / X7R / 0603; Component Type: SMD; Temperature Range: -55°C ~ 125°C; Tolerance: ±10%; ComponentLink1URL: https://media.digikey.com/pdf/Data%20Sheets/Samsung%20PDFs/CL_Series_MLCC_ds.pdf; Supplier 1: Digi-Key; Supplier Part Number 1: CL10B104KB8NNND-ND; Price: 0,0039378; ComponentLink1Description: Datasheet
C8 C11 C12 = C2012JB1V226M125AC: 22uF 35V JB ±20% 0805 Ceramic Capacitor RoHS; Manufacturer: TDK Corporation; Ajax_1C_ID: 32073; Ajax_1C_PN: 22uF 35V 20% 0805 TDK C2012JB1V226M125AC Ceramic Capacitors RoHS; Ajax_1С_Status: RND Only; Standard Lead Time: 30 Weeks; Component Status: Released; Replacement: NONE; GUID_1C: 562d6396-e930-11eb-ab74-0050569f2651; Value: 22uF; Part Number: C2012JB1V226M125AC; Part Type: Ceramic / JB / 0805; Component Type: SMD; Temperature Range: -25°C ~ 85°C; Tolerance: ±20%; ComponentLink1URL: https://product.tdk.com/info/en/catalog/datasheets/mlcc_commercial_general_en.pdf; Supplier 1: Mouser; Supplier Part Number 1: 810-C2012JB1V226M12C; Price: 0,567; ComponentLink1Description: Datasheet
C27 = MRA-025V221MF105-T/R: 220uF 25V ±20% Size F 8x10.5mm SMD Aluminum Electrolytic Capacitor; Manufacturer: Koshin; Ajax_1C_ID: 44442; Ajax_1C_PN: 220uF 25V 20% 8x10.5 MRA-025V221MF105-T/R Koshin Aluminum Electrolytic Capacitor SMD; Ajax_1С_Status: RND Only; Standard Lead Time: NONE; Component Status: Released; GUID_1C: b722054d-ee29-11ec-a915-00505699469b; Part Number: MRA-025V221MF105-T/R; Part Type: Aluminum; Component Type: SMD; Temperature Range: -40°C ~ 105°C; Tolerance: ±20%; Dielectric Type: NONE; ComponentLink1URL: \\altiumdb.ajax.local\files\Datasheet\Capacitor\MRA-25V22 5X5.4,25V220 8X10.5(2022-5-14)Ajax.pdf; Replacement: NONE; Price: 0; ComponentLink1Description: Datasheet
D1 = AP62300WU-7: 4.35V to 18V, 2A, High Efficiency Synchronous Step Down Converter, 500kHz, SOT-23-6; Manufacturer: Diodes Incorporated; Ajax_1С_Status: RND Only; Component Status: Released; Replacement: NONE; Part Type: Power / DC-DC / Buck; Component Type: SMD; Temperature Range: -40°C ~ 85°C; ComponentLink1Description: Datasheet; Package: SOT-23-6; Part Number: AP62300WU-7
L1 = SRN4018-4R7M: 4.7uH Semi-Shielded Wirewound Inductor 1.9A 84mOhm Max; Manufacturer: Bourns Inc; Ajax_1C_ID: 20972; Ajax_1C_PN: 4.7uH SRN4018-4R7M SMD Индуктивность; Ajax_1С_Status: RND Only; Saturation Current: 2A; Tolerance: ±20%; Component Status: Released; Standard Lead Time: 42 Weeks; Replacement: NONE; GUID_1C: 7ba8f5fd-b629-11ea-ab61-0050569f2651; Value: 4.7uH; Part Number: SRN4018-4R7M; Part Type: Power / Ferrite Core; Component Type: SMD; Temperature Range: -25°C ~ 120°C; ComponentLink1URL: https://eu.mouser.com/datasheet/2/54/srn4018-1391320.pdf; Supplier 1: Mouser; Supplier Part Number 1: 652-SRN4018-4R7M; Price: 0,291; ComponentLink1Description: Datasheet
R2 = RC0402FR-0756K2L: 56.2 kOhms ±1% 1/16W 0402 Thick Film Resistor; Manufacturer: Yageo; Ajax_1C_ID: 20241; Ajax_1C_PN: 56.2k 1% 0402 Resistors SMD RoHS; Ajax_1С_Status: Mass Production; Power Rating: 0.062W; Voltage: 50V; Component Status: Released; Temperature Stability: ±100ppm/°C; Replacement: NONE; GUID_1C: 73881b35-8945-11ea-ab60-0050569f2651; Value: 56.2k; Part Number: RC0402FR-0756K2L; Component Type: SMD; Part Type: Thick Film; Temperature Range: -55°C ~ 155°C; ComponentLink1URL: https://eu.mouser.com/datasheet/2/447/PYu_RC_Group_51_RoHS_L_11-1984063.pdf; Supplier 1: Digi-Key; Supplier Part Number 1: YAG3187TR-ND; Price: 0,00065; ComponentLink1Description: Datasheet
R3 = RC0402FR-0710KL: as R4 on sheet MBR; Value: 10k; Part Number: RC0402FR-0710KL; Component Type: SMD; Part Type: Thick Film; Temperature Range: -55°C ~ 155°C; ComponentLink1URL: https://eu.mouser.com/datasheet/2/447/PYu_RC_Group_51_RoHS_L_10-1664068.pdf; Supplier 1: Digi-Key; Supplier Part Number 1: 311-10.0KLRTR-ND; Price: 0,00065; ComponentLink1Description: Datasheet

## Sheet EEPROM.SchDoc: =DocumentName
size A4; Author: Vitech-ua; CompanyName: "AS Manufacturing" LLC; Organization: "AS Manufacturing" LLC; Address1: 5 Sklyarenka St.; Address2: Kyiv 04073; Address3: Ukraine; Address4: https://ajax.systems/en/; Revision: v1; SheetNumber: 3; SheetTotal: 5; Product name: INVERTOR; Internal reference: 002; Head: INVERTOR.002.v1; PCB_Designator: INVERTOR.002.v1; Template_version: 1.0.1
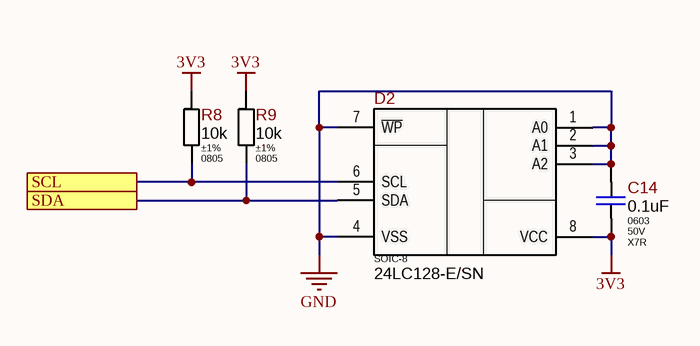
[diagram p2: EEPROM.SchDoc]

### Parts
C14  Package: 0603  Voltage: 50V  Dielectric Type: X7R  [C_CERAMIC_0603_MED]  (hidden comment: 0.1uF)
D2  Package: SOIC-8  [SOIC-8_W3.9MM]  (hidden comment: 24LC128-E/SN)
R8  Tolerance: ±1%  Package: 0805  [R_ANY_CHIP_0805_MED]  (hidden comment: 10k)
R9  Tolerance: ±1%  Package: 0805  [R_ANY_CHIP_0805_MED]  (hidden comment: 10k)

### Ports
SCL, SDA

### Nets
3V3: C14.1 D2.8(VCC) R8.2 R9.2
GND: C14.2 D2.1(A0) D2.2(A1) D2.3(A2) D2.4(VSS) D2.7(~{WP})
SCL: D2.6(SCL) R8.1 ; port SCL
SDA: D2.5(SDA) R9.1 ; port SDA

### Notes on the sheet
- Title
- Product:
- Project:
- Size:
- Date:
- Variant:
- A4
- Authors:
- Time:
- Sheet
- of
- Revision:
- @Vitech_ua
- Commit:

### Library data of the parts
C14 = CL10B104KB8NNND: as C1 on sheet MBR; Value: 0.1uF; Part Number: CL10B104KB8NNND; Part Type: Ceramic / X7R / 0603; Component Type: SMD; Temperature Range: -55°C ~ 125°C; Tolerance: ±10%; ComponentLink1URL: https://media.digikey.com/pdf/Data%20Sheets/Samsung%20PDFs/CL_Series_MLCC_ds.pdf; Supplier 1: Digi-Key; Supplier Part Number 1: CL10B104KB8NNND-ND; Price: 0,0039378; ComponentLink1Description: Datasheet
D2 = 24LC128-E/SN: EEPROM Memory IC 128Kb (16K x 8), I2C, 400kHz, 900ns, SOIC-8; Manufacturer: Microchip Technology; Ajax_1C_ID: 10590; Ajax_1C_PN: 24LC128-E/SN SO8; Ajax_1С_Status: RND Only; Standard Lead Time: 6 Weeks; Component Status: On Review; Replacement: NONE; GUID_1C: 19c1e12f-7c36-11e7-813c-14dda9d2d04d; Part Type: Memory / EEPROM; Component Type: SMD; Temperature Range: -40°C ~ 125°C; ComponentLink1URL: http://www.microchip.com/mymicrochip/filehandler.aspx?ddocname=en011851; Supplier 1: Mouser; Supplier Part Number 1: 579-24LC128-E/SN; Price: 0,83; ComponentLink1Description: Datasheet; Part Number: 24LC128-E/SN
R8 R9 = RC0805FR-0710K2L: as R5 on sheet MBR; Value: 10k; Part Number: RC0805FR-0710K2L; Component Type: SMD; Part Type: Thick Film; Temperature Range: -55°C ~ 155°C; ComponentLink1URL: https://eu.mouser.com/datasheet/2/447/PYu_RC_Group_51_RoHS_L_10-1664068.pdf; Supplier 1: Digi-Key; Supplier Part Number 1: 311-10.2KCRTR-ND; Price: 0,0014; ComponentLink1Description: Datasheet

## Sheet LDO.SchDoc: =DocumentName
size A4; Author: Vitech-ua; CompanyName: "AS Manufacturing" LLC; Organization: "AS Manufacturing" LLC; Address1: 5 Sklyarenka St.; Address2: Kyiv 04073; Address3: Ukraine; Address4: https://ajax.systems/en/; Revision: v1; SheetNumber: 4; SheetTotal: 5; Product name: INVERTOR; Internal reference: 002; Head: INVERTOR.002.v1; PCB_Designator: INVERTOR.002.v1; Template_version: 1.0.1
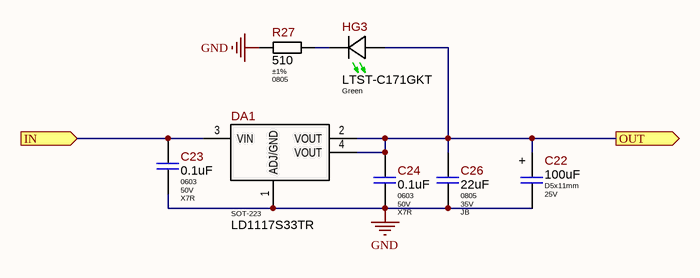
[diagram p3: LDO.SchDoc]

### Parts
C22  value 100uF  Package: D5x11mm  Voltage: 25V  [CAP-AE-PTH-50D05x110H15]  (hidden comment: 100uFx25V)
C23  Package: 0603  Voltage: 50V  Dielectric Type: X7R  [C_CERAMIC_0603_MED]  (hidden comment: 0.1uF)
C24  Package: 0603  Voltage: 50V  Dielectric Type: X7R  [C_CERAMIC_0603_MED]  (hidden comment: 0.1uF)
C26  Package: 0805  Voltage: 35V  Dielectric Type: JB  [CAP-0805(2012)X125T20]  (hidden comment: 22uF)
DA1  LD1117S33TR  [SOT-223]
HG3  Color: Green  [LTST-C171GKT]  (hidden comment: LTST-C171GKT)
R27  Tolerance: ±1%  Package: 0805  [R_ANY_CHIP_0805_MED]  (hidden comment: 510)

### Ports
IN (in), OUT (out)

### Nets
3V3: C22.1 C24.2 C26.1 DA1.2(VOUT) DA1.4(VOUT) HG3.AN(Anode) ; port OUT
5V: C23.2 DA1.3(VIN) ; port IN
GND: C22.2 C23.1 C24.1 C26.2 DA1.1(ADJ/GND) R27.2
NetHG3_CA: HG3.CA(Cathode) R27.1

### Notes on the sheet
- Title
- Product:
- Project:
- Size:
- Date:
- Variant:
- A4
- Authors:
- Time:
- Sheet
- of
- Revision:
- @Vitech_ua
- Commit:
- (in symbol KRM-025V101MC110-T/A2) +

### Library data of the parts
C22 = KRM-025V101MC110-T/A2: 100uF 25V ±20% D5x11mm 105℃ Aluminum Electrolytic Capacitor; Manufacturer: Koshin; Ajax_1C_ID: 55676; Ajax_1C_PN: 100uF 25V 20% 5x11mm KRM-025V101MC110-T/A2 Koshin Capacitors SMD RoHS; Ajax_1С_Status: RND Only; Standard Lead Time: NONE; Component Status: Released; GUID_1C: cc76a443-6c07-11ed-a366-005056994834; Part Number: KRM-025V101MC110-T/A2; Part Type: Aluminum; Component Type: PTH; Temperature Range: -40°C ~ 105°C; Tolerance: ±20%; Dielectric Type: NONE; ComponentLink1URL: \\altiumdb.ajax.local\files\Datasheet\Capacitor\Koshin - KRM Series.pdf; Replacement: NONE; Price: 0; ComponentLink1Description: Datasheet
C23 C24 = CL10B104KB8NNND: as C1 on sheet MBR; Value: 0.1uF; Part Number: CL10B104KB8NNND; Part Type: Ceramic / X7R / 0603; Component Type: SMD; Temperature Range: -55°C ~ 125°C; Tolerance: ±10%; ComponentLink1URL: https://media.digikey.com/pdf/Data%20Sheets/Samsung%20PDFs/CL_Series_MLCC_ds.pdf; Supplier 1: Digi-Key; Supplier Part Number 1: CL10B104KB8NNND-ND; Price: 0,0039378; ComponentLink1Description: Datasheet
C26 = C2012JB1V226M125AC: as C8 on sheet STEP_DOWN_3V3; Value: 22uF; Part Number: C2012JB1V226M125AC; Part Type: Ceramic / JB / 0805; Component Type: SMD; Temperature Range: -25°C ~ 85°C; Tolerance: ±20%; ComponentLink1URL: https://product.tdk.com/info/en/catalog/datasheets/mlcc_commercial_general_en.pdf; Supplier 1: Mouser; Supplier Part Number 1: 810-C2012JB1V226M12C; Price: 0,567; ComponentLink1Description: Datasheet
DA1 = LD1117S33TR: Adjustable and fixed low drop positive voltage regulator, 3.3V 800mA, 1.25V to 15V Vin; Manufacturer: STMicroelectronics; Ajax_1C_ID: 1306; Ajax_1C_PN: LD1117S33TR LDO voltage regulators; Ajax_1С_Status: Mass Production; Standard Lead Time: 10 Weeks; Component Status: Released; Replacement: NONE; GUID_1C: 8fe842de-dd43-11e0-af93-6c626deda1bb; Package: SOT-223; Part Number: LD1117S33TR; Part Type: Power / Linear Regulator; Component Type: SMD; Temperature Range: 0°C ~ 125°C; ComponentLink1URL: https://www.st.com/content/ccc/resource/technical/document/datasheet/99/3b/7d/91/91/51/4b/be/CD00000544.pdf/files/CD00000544.pdf/jcr:content/translations/en.CD00000544.pdf; Supplier 1: Digi-Key; Supplier Part Number 1: 497-1242-2-ND; Price: 0,103; ComponentLink1Description: Datasheet
HG3 = LTST-C171GKT: as HG2 on sheet MBR; Part Number: LTST-C171GKT; Part Type: LED / 0805; Component Type: SMD; Package: 0805; Wavelength: 565nm; Temperature Range: -55°C ~ 85°C; ComponentLink1URL: https://media.digikey.com/pdf/Data%20Sheets/Lite-On%20PDFs/LTST-C171GKT.pdf; Supplier 1: Digi-Key; Supplier Part Number 1: 160-1423-2-ND; Price: 0,0319; ComponentLink1Description: Datasheet
R27 = ERJ-P06F5100V: as R24 on sheet MBR; Value: 510; Part Number: ERJ-P06F5100V; Component Type: SMD; Part Type: Thick Film / Anti-Surge/Pulse Withstanding; Temperature Range: -55°C ~ 155°C; ComponentLink1URL: https://eu.mouser.com/datasheet/2/315/AOA0000C331-1141874.pdf; Supplier 1: Mouser; Supplier Part Number 1: 667-ERJ-P06F5100V; Price: 0,036096; ComponentLink1Description: Datasheet

## Sheet BUTTONS.SchDoc: =DocumentName
size A4; Author: Vitech-ua; CompanyName: "AS Manufacturing" LLC; Organization: "AS Manufacturing" LLC; Address1: 5 Sklyarenka St.; Address2: Kyiv 04073; Address3: Ukraine; Address4: https://ajax.systems/en/; Revision: v1; SheetNumber: 5; SheetTotal: 5; Product name: INVERTOR; Internal reference: 002; Head: INVERTOR.002.v1; PCB_Designator: INVERTOR.002.v1; Template_version: 1.0.1
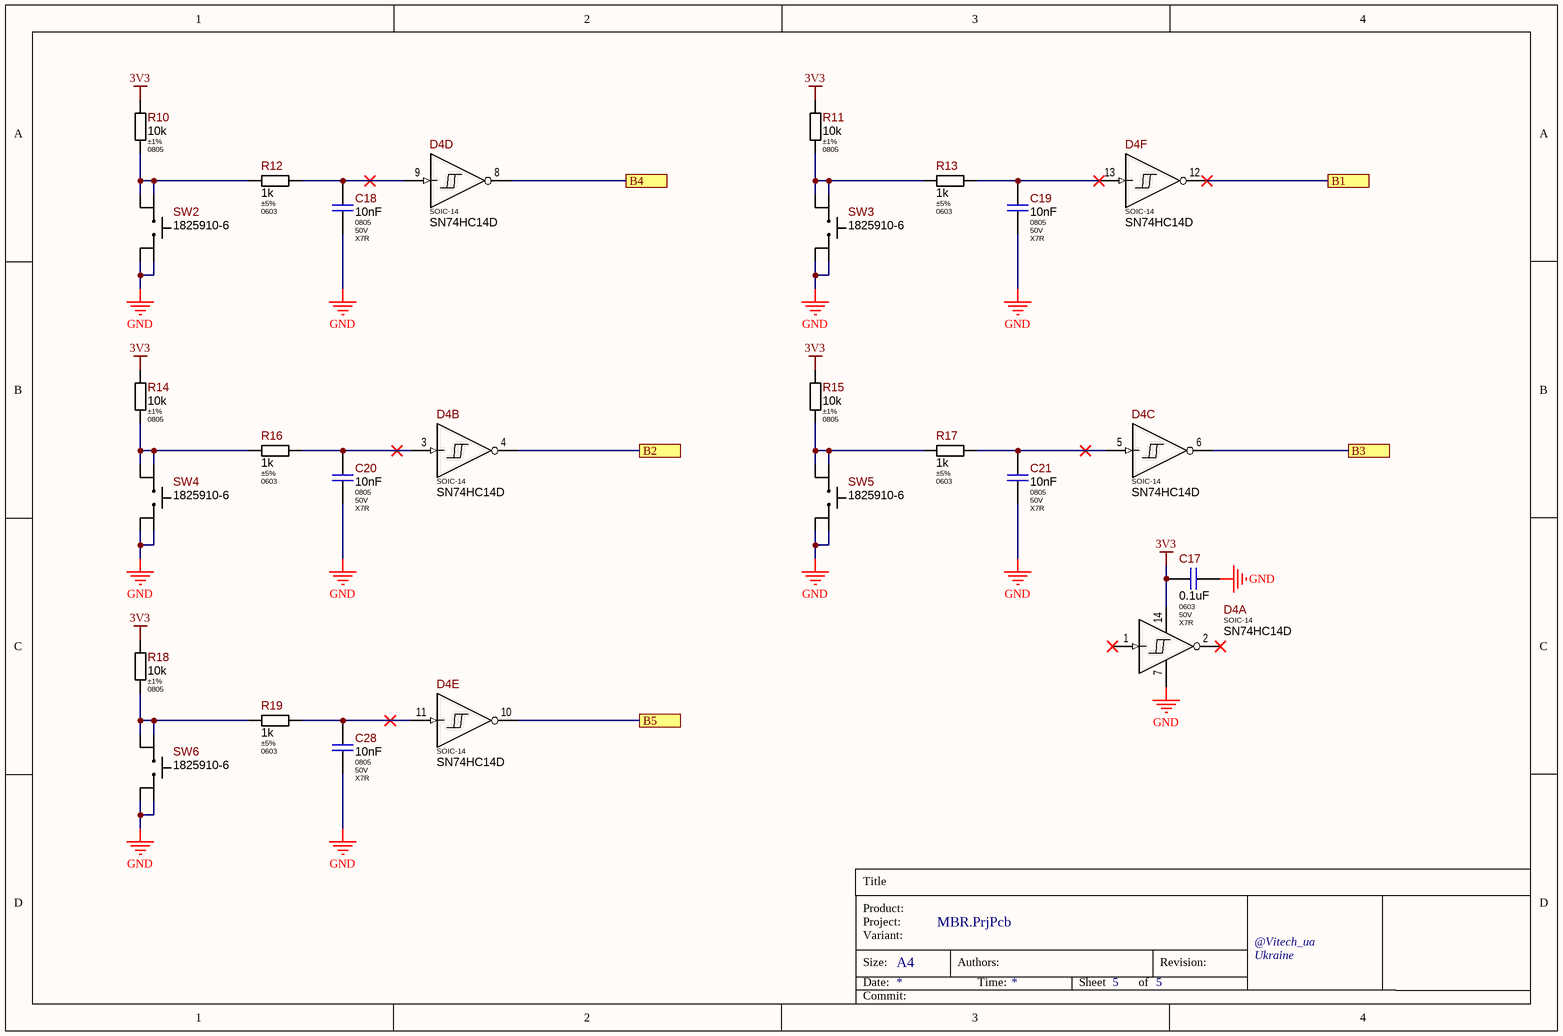
[diagram p4: BUTTONS.SchDoc]

### Parts
C17  Package: 0603  Voltage: 50V  Dielectric Type: X7R  [C_CERAMIC_0603_MED]  (hidden comment: 0.1uF)
C18  Package: 0805  Voltage: 50V  Dielectric Type: X7R  [CAP-0805(2012)X65T10]  (hidden comment: 10nF)
C19  Package: 0805  Voltage: 50V  Dielectric Type: X7R  [CAP-0805(2012)X65T10]  (hidden comment: 10nF)
C20  Package: 0805  Voltage: 50V  Dielectric Type: X7R  [CAP-0805(2012)X65T10]  (hidden comment: 10nF)
C21  Package: 0805  Voltage: 50V  Dielectric Type: X7R  [CAP-0805(2012)X65T10]  (hidden comment: 10nF)
C28  Package: 0805  Voltage: 50V  Dielectric Type: X7R  [CAP-0805(2012)X65T10]  (hidden comment: 10nF)
D4  SN74HC14D  [SOIC-14]  (parts A,B,C,D,E,F of 6)
R10  Tolerance: ±1%  Package: 0805  [R_ANY_CHIP_0805_MED]  (hidden comment: 10k)
R11  Tolerance: ±1%  Package: 0805  [R_ANY_CHIP_0805_MED]  (hidden comment: 10k)
R12  Tolerance: ±5%  Package: 0603  [R_ANY_CHIP_0603_MED]  (hidden comment: 1k)
R13  Tolerance: ±5%  Package: 0603  [R_ANY_CHIP_0603_MED]  (hidden comment: 1k)
R14  Tolerance: ±1%  Package: 0805  [R_ANY_CHIP_0805_MED]  (hidden comment: 10k)
R15  Tolerance: ±1%  Package: 0805  [R_ANY_CHIP_0805_MED]  (hidden comment: 10k)
R16  Tolerance: ±5%  Package: 0603  [R_ANY_CHIP_0603_MED]  (hidden comment: 1k)
R17  Tolerance: ±5%  Package: 0603  [R_ANY_CHIP_0603_MED]  (hidden comment: 1k)
R18  Tolerance: ±1%  Package: 0805  [R_ANY_CHIP_0805_MED]  (hidden comment: 10k)
R19  Tolerance: ±5%  Package: 0603  [R_ANY_CHIP_0603_MED]  (hidden comment: 1k)
SW2  FSM4JH  [1825910-6]  (value not drawn)
SW3  FSM4JH  [1825910-6]  (value not drawn)
SW4  FSM4JH  [1825910-6]  (value not drawn)
SW5  FSM4JH  [1825910-6]  (value not drawn)
SW6  FSM4JH  [1825910-6]  (value not drawn)

### Ports
B1, B2, B3, B4, B5

### Nets
3V3: C17.1 D4.14(VCC) R10.1 R11.1 R14.1 R15.1 R18.1
GND: C17.2 C18.2 C19.2 C20.2 C21.2 C28.2 D4.7(GND) SW2.3 SW2.4 SW3.3 SW3.4 SW4.3 SW4.4 SW5.3 SW5.4 SW6.3 SW6.4
BTN_BK: D4.8 ; port B4
BTN_DW: D4.12 ; port B1
BTN_OK: D4.6 ; port B3
BTN_UP: D4.4 ; port B2
BTN_XX: D4.10 ; port B5
NetC18_1: C18.1 D4.9 R12.2
NetC19_1: C19.1 D4.13 R13.2
NetC20_1: C20.1 D4.3 R16.2
NetC21_1: C21.1 D4.5 R17.2
NetC28_1: C28.1 D4.11 R19.2
NetR10_2: R10.2 R12.1 SW2.1 SW2.2
NetR11_2: R11.2 R13.1 SW3.1 SW3.2
NetR14_2: R14.2 R16.1 SW4.1 SW4.2
NetR15_2: R15.2 R17.1 SW5.1 SW5.2
NetR18_2: R18.2 R19.1 SW6.1 SW6.2

Not connected (* = marked no-connect by the designer): D4 1* 2*

### Notes on the sheet
- Title
- Product:
- Project:
- Size:
- Date:
- Variant:
- A4
- Authors:
- Time:
- Sheet
- of
- Revision:
- @Vitech_ua
- Commit:

### Library data of the parts
C17 = CL10B104KB8NNND: as C1 on sheet MBR; Value: 0.1uF; Part Number: CL10B104KB8NNND; Part Type: Ceramic / X7R / 0603; Component Type: SMD; Temperature Range: -55°C ~ 125°C; Tolerance: ±10%; ComponentLink1URL: https://media.digikey.com/pdf/Data%20Sheets/Samsung%20PDFs/CL_Series_MLCC_ds.pdf; Supplier 1: Digi-Key; Supplier Part Number 1: CL10B104KB8NNND-ND; Price: 0,0039378; ComponentLink1Description: Datasheet
C18-C21 C28 = CL21B103KBANNNC: 10nF 50V X7R ±10% 0805 Ceramic Capacitor RoHS; Manufacturer: Samsung Electro-Mechanics; Ajax_1C_PN: NONE; Ajax_1С_Status: RND Only; Standard Lead Time: 26 Weeks; Component Status: Released; Value: 10nF; Part Number: CL21B103KBANNNC; Part Type: Ceramic / X7R / 0805; Component Type: SMD; Temperature Range: -55°C ~ 125°C; Tolerance: ±10%; ComponentLink1URL: https://eu.mouser.com/datasheet/2/585/MLCC-1837944.pdf; Supplier 1: Mouser; Supplier Part Number 1: 187-CL21B103KBANNNC; Replacement: NONE; Price: NONE; ComponentLink1Description: Datasheet
D4 = SN74HC14D: Hex Inverters with Schmitt-Trigger Inputs, SOIC-14; Manufacturer: Texas Instruments; Ajax_1C_ID: 67389; Ajax_1C_PN: SN74HC14D Inverter IC 6 Channel Schmitt Trigger 14-SOIC TI; Ajax_1С_Status: RND Only; Standard Lead Time: 50 Weeks; Component Status: Released; Replacement: NONE; GUID_1C: 72d75cb0-dd3a-11ed-a36c-005056994834; Package: SOIC-14; Part Number: SN74HC14D; Part Type: Logic / Inverters; Component Type: SMD; Temperature Range: -40°C ~ 85°C; ComponentLink1URL: https://www.ti.com/lit/ds/symlink/sn54hc14-sp.pdf; Supplier 1: Mouser; Supplier Part Number 1: 595-SN74HC14D; Price: 0,19; ComponentLink1Description: Datasheet
R10 R11 R14 R15 R18 = RC0805FR-0710K2L: as R5 on sheet MBR; Value: 10k; Part Number: RC0805FR-0710K2L; Component Type: SMD; Part Type: Thick Film; Temperature Range: -55°C ~ 155°C; ComponentLink1URL: https://eu.mouser.com/datasheet/2/447/PYu_RC_Group_51_RoHS_L_10-1664068.pdf; Supplier 1: Digi-Key; Supplier Part Number 1: 311-10.2KCRTR-ND; Price: 0,0014; ComponentLink1Description: Datasheet
R12 R13 R16 R17 R19 = RC0603JR-071KL: 1 kOhms ±5%, 1/10W 0603 Thick Film Resistor; Manufacturer: Yageo; Ajax_1C_ID: 28124; Ajax_1C_PN: 1k 5% 0603 Resistors SMD RoHS; Ajax_1С_Status: Mass Production; Power Rating: 0.1W; Voltage: 75V; Component Status: Released; Temperature Stability: ±100ppm/°C; Replacement: NONE; GUID_1C: fbc5fd6b-8d66-11eb-ab70-0050569f2651; Value: 1k; Part Number: RC0603JR-071KL; Component Type: SMD; Part Type: Thick Film; Temperature Range: -55°C ~ 155°C; ComponentLink1URL: https://eu.mouser.com/datasheet/2/447/PYu_RC_Group_51_RoHS_L_11-1984063.pdf; Supplier 1: Digi-Key; Supplier Part Number 1: 311-1.0KGRTR-ND; Price: 0,00072; ComponentLink1Description: Datasheet
SW2-SW6 = 1825910-6: Tactile Switch, SPST-NO, Top Actuated, PTH; Manufacturer: TE Connectivity; Ajax_1C_PN: NONE; Ajax_1С_Status: RND Only; Component Status: On Review; Part Number: 1825910-6; Part Type: Switch / Tactile; Component Type: PTH; Temperature Range: -35°C ~ 85°C; ComponentLink1URL: https://www.te.com/commerce/DocumentDelivery/DDEController?Action=srchrtrv&DocNm=1825910&DocType=Customer+Drawing&DocLang=English; Supplier 1: Digi-Key; Supplier Part Number 1: 450-1650-ND; Replacement: NONE; Price: NONE; ComponentLink1Description: Datasheet

## Nets that join several sheets
3V3: MBR (18 pins), EEPROM (C14.1 D2.8 R8.2 R9.2), LDO (6 pins), BUTTONS (7 pins)
5V: MBR (C29.1 TP3.1 VD1.4 X6.2), STEP_DOWN_3V3 (C11.1 C12.1 L1.2 R2.2), LDO (C23.2 DA1.3)
+VBAT: MBR (FP1.1 X2.1), STEP_DOWN_3V3 (5 pins)
GND: MBR (47 pins), STEP_DOWN_3V3 (7 pins), EEPROM (6 pins), LDO (6 pins), BUTTONS (17 pins)
BTN_BK: MBR (DD1.27), BUTTONS (D4.8)
BTN_DW: MBR (DD1.32), BUTTONS (D4.12)
BTN_OK: MBR (DD1.26), BUTTONS (D4.6)
BTN_UP: MBR (DD1.28), BUTTONS (D4.4)
BTN_XX: MBR (DD1.30), BUTTONS (D4.10)
SCL: MBR (D3.12 DD1.42 X4.1), EEPROM (D2.6 R8.1)
SDA: MBR (D3.13 DD1.43 X4.3), EEPROM (D2.5 R9.1)